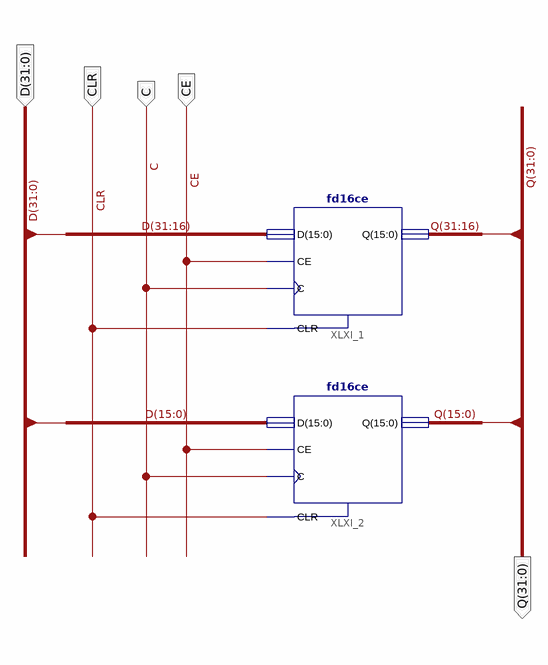
[diagram p0: schematic sheet 1]
// Xilinx ISE schematic reg32.sch (spartan6) as structural Verilog: 2 symbols, 5 ports
module reg32 (
  input  [31:0] D,
  input  CLR,
  input  C,
  input  CE,
  output [31:0] Q
);

  fd16ce XLXI_1 (.C(C), .CE(CE), .CLR(CLR), .D(D[31:16]), .Q(Q[31:16]));
  fd16ce XLXI_2 (.C(C), .CE(CE), .CLR(CLR), .D(D[15:0]), .Q(Q[15:0]));
endmodule
